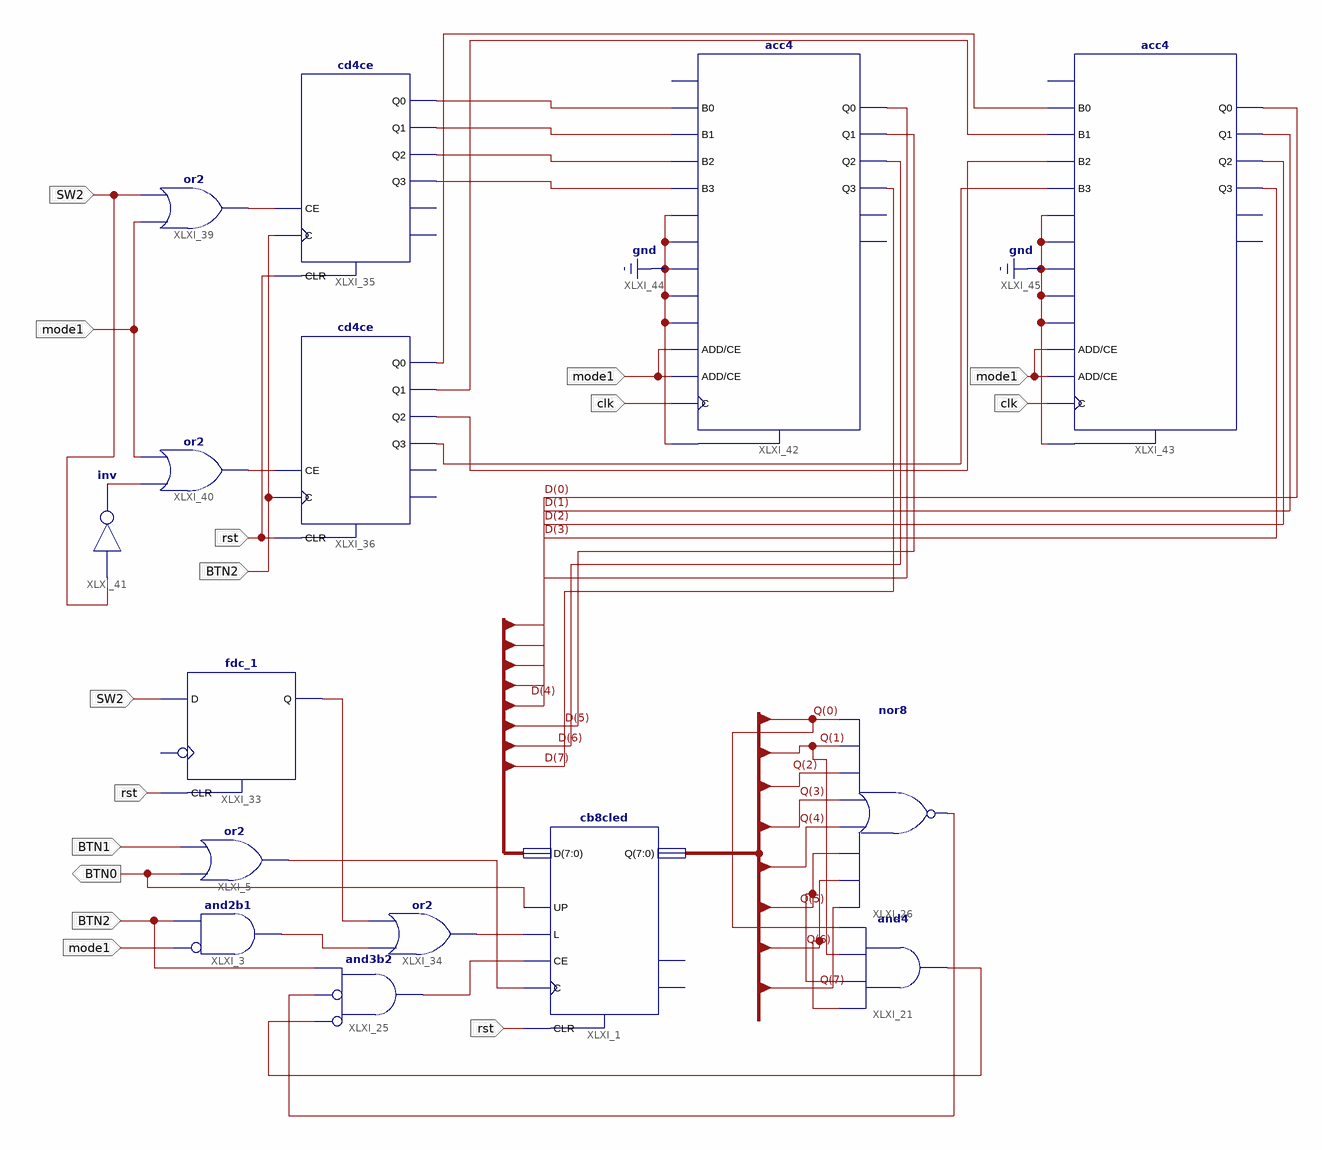
[diagram p0: schematic sheet 1]
// Xilinx ISE schematic mode_1_updown.sch (spartan3) as structural Verilog: 15 symbols, 7 ports
module mode_1_updown (
  input  rst,
  input  BTN2,
  input  mode1,
  input  BTN1,
  input  SW2,
  input  clk,
  output BTN0
);

  wire XLXN_9, XLXN_67, XLXN_69, XLXN_72, XLXN_88, XLXN_89, XLXN_90, XLXN_95, XLXN_97, XLXN_98, XLXN_99,
       XLXN_100, XLXN_101, XLXN_102, XLXN_103, XLXN_104, XLXN_105, XLXN_106;
  wire [7:0] D, Q, XLXN_121, XLXN_143;

  cb8cled XLXI_1 (
    .C(XLXN_9), .CE(XLXN_67), .CLR(rst), .D(XLXN_121), .L(XLXN_90), .UP(BTN0), .Q(XLXN_143));  // open: CEO, TC
  and XLXI_3 (XLXN_89, ~mode1, BTN2);  // and2b1
  or XLXI_5 (XLXN_9, BTN0, BTN1);
  and XLXI_25 (XLXN_67, ~XLXN_69, ~XLXN_72, BTN2);  // and3b2
  and XLXI_21 (XLXN_69, Q[6], Q[5], Q[1], Q[0]);
  nor XLXI_26 (XLXN_72, Q[7], Q[6], Q[5], Q[4], Q[3], Q[2], Q[1], Q[0]);
  fdc_1 XLXI_33 (.CLR(rst), .D(SW2), .Q(XLXN_88));  // open: C
  or XLXI_34 (XLXN_90, XLXN_89, XLXN_88);
  cd4ce XLXI_35 (
    .C(BTN2), .CE(XLXN_97), .CLR(rst), .Q0(XLXN_99), .Q1(XLXN_100), .Q2(XLXN_101), .Q3(XLXN_102));  // open: CEO, TC
  cd4ce XLXI_36 (
    .C(BTN2), .CE(XLXN_98), .CLR(rst), .Q0(XLXN_103), .Q1(XLXN_104), .Q2(XLXN_105), .Q3(XLXN_106));  // open: CEO, TC
  or XLXI_39 (XLXN_97, mode1, SW2);
  or XLXI_40 (XLXN_98, XLXN_95, mode1);
  not XLXI_41 (XLXN_95, SW2);
  acc4 XLXI_42 (
    .ADD(mode1), .B0(XLXN_99), .B1(XLXN_100), .B2(XLXN_101), .B3(XLXN_102), .C(clk), .CE(mode1), .D0(1'b0),
    .D1(1'b0), .D2(1'b0), .D3(1'b0), .L(1'b0), .R(1'b0), .Q0(D[4]), .Q1(D[5]), .Q2(D[6]), .Q3(D[7]));  // open: CI, CO, OFL
  acc4 XLXI_43 (
    .ADD(mode1), .B0(XLXN_103), .B1(XLXN_104), .B2(XLXN_105), .B3(XLXN_106), .C(clk), .CE(mode1), .D0(1'b0),
    .D1(1'b0), .D2(1'b0), .D3(1'b0), .L(1'b0), .R(1'b0), .Q0(D[0]), .Q1(D[1]), .Q2(D[2]), .Q3(D[3]));  // open: CI, CO, OFL
endmodule
